# Altium schematic sheet cs301_Group5.SchDoc: CS301 Sensor PCB
size A4; Author: Group 5; DrawnBy: Group 5; SheetNumber: 1; SheetTotal: 2
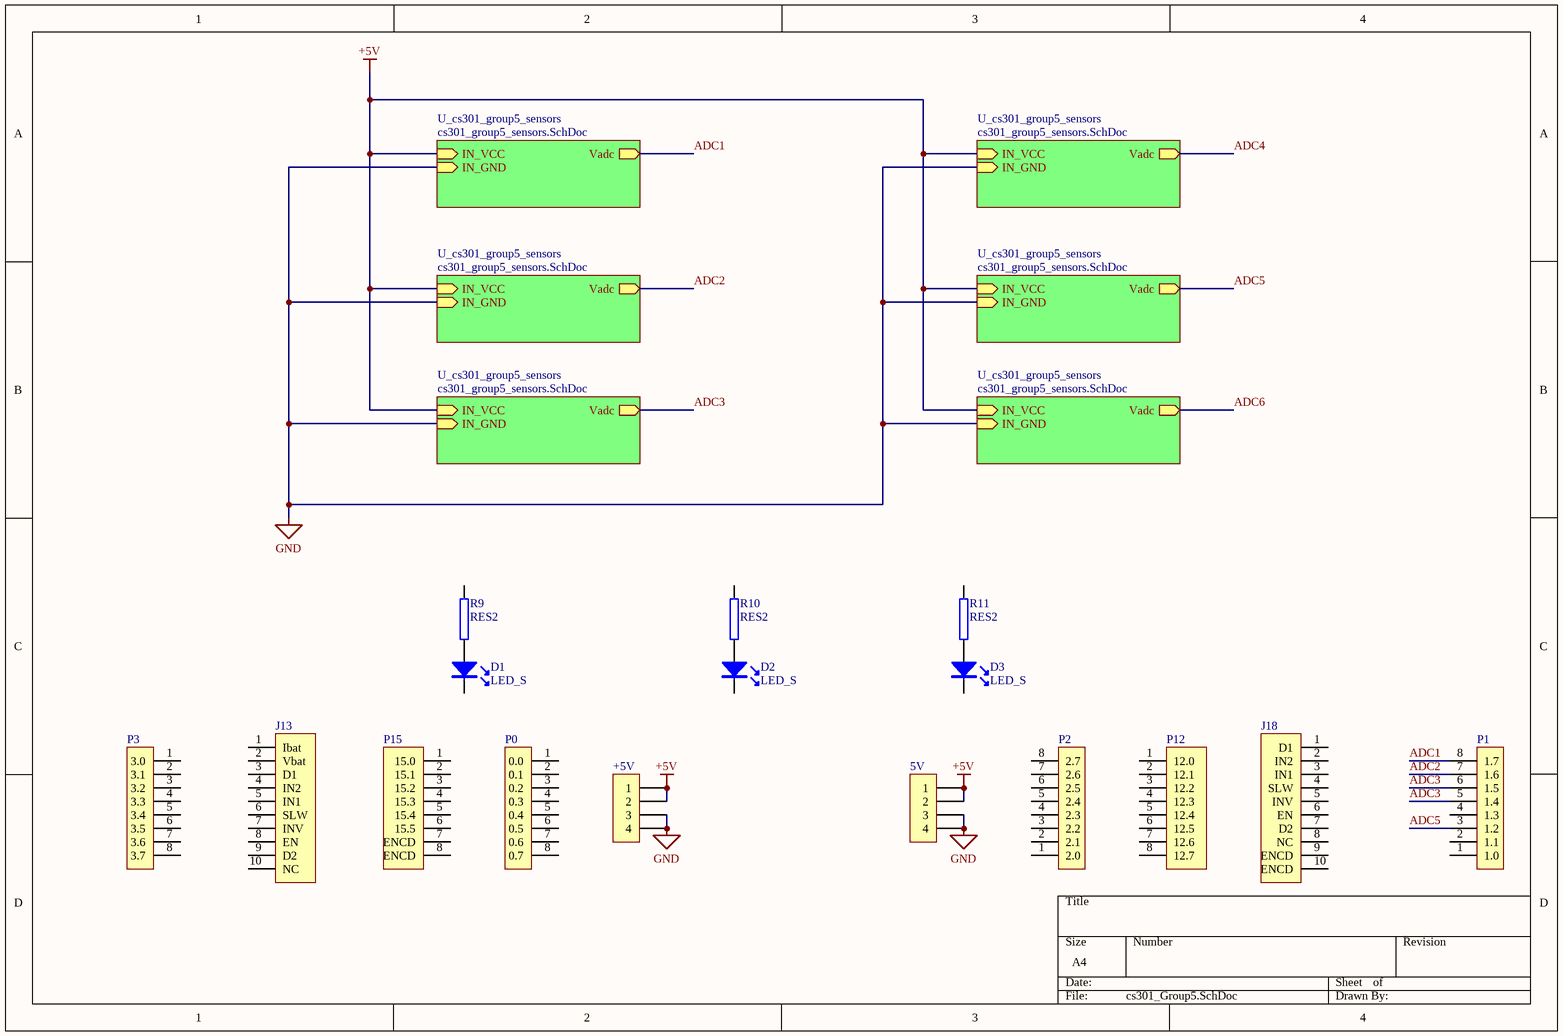
[diagram p0: cs301_Group5.SchDoc]

## Parts
5V  5V  [IDC4]  (value not drawn)
+5V  5V  [IDC4]  (value not drawn)
D1  LED_S  [LED0.1/5MM]
D2  LED_S  [LED0.1/5MM]
D3  LED_S  [LED0.1/5MM]
J13  CON10  [idc10]  (value not drawn)
J18  CON10  [IDC10]  (value not drawn)
P0  P0  [idc8]  (value not drawn)
P1  P1  [idc8]  (value not drawn)
P2  P2  [idc8]  (value not drawn)
P3  P3  [idc8]  (value not drawn)
P12  P12  [idc8]  (value not drawn)
P15  P15  [idc8]  (value not drawn)
R9  RES2  [AXIAL0.4]
R10  RES2  [AXIAL0.4]
R11  RES2  [AXIAL0.4]

## Sub-sheets
U_cs301_group5_sensors = cs301_group5_sensors.SchDoc: Vadc (out), IN_VCC (in), IN_GND (in)
U_cs301_group5_sensors = cs301_group5_sensors.SchDoc: Vadc (out), IN_VCC (in), IN_GND (in)
U_cs301_group5_sensors = cs301_group5_sensors.SchDoc: Vadc (out), IN_VCC (in), IN_GND (in)
U_cs301_group5_sensors = cs301_group5_sensors.SchDoc: Vadc (out), IN_VCC (in), IN_GND (in)
U_cs301_group5_sensors = cs301_group5_sensors.SchDoc: Vadc (out), IN_VCC (in), IN_GND (in)
U_cs301_group5_sensors = cs301_group5_sensors.SchDoc: Vadc (out), IN_VCC (in), IN_GND (in)

## Nets
+5V: 5V.1 5V.2 +5V.1 +5V.2 ; sheet U_cs301_group5_sensors/IN_VCC, sheet U_cs301_group5_sensors/IN_VCC, sheet U_cs301_group5_sensors/IN_VCC, sheet U_cs301_group5_sensors/IN_VCC, sheet U_cs301_group5_sensors/IN_VCC, sheet U_cs301_group5_sensors/IN_VCC
GND: 5V.3 5V.4 +5V.3 +5V.4 ; sheet U_cs301_group5_sensors/IN_GND, sheet U_cs301_group5_sensors/IN_GND, sheet U_cs301_group5_sensors/IN_GND, sheet U_cs301_group5_sensors/IN_GND, sheet U_cs301_group5_sensors/IN_GND, sheet U_cs301_group5_sensors/IN_GND
ADC1: P1.8(1.7) ; sheet U_cs301_group5_sensors/Vadc
ADC2: P1.7(1.6) ; sheet U_cs301_group5_sensors/Vadc
ADC3: P1.5(1.4) P1.6(1.5) ; sheet U_cs301_group5_sensors/Vadc
ADC4: sheet U_cs301_group5_sensors/Vadc
ADC5: P1.3(1.2) ; sheet U_cs301_group5_sensors/Vadc
ADC6: sheet U_cs301_group5_sensors/Vadc
NetD1_A: D1.A R9.1
NetD2_A: D2.A R10.1
NetD3_A: D3.A R11.2

Not connected (* = marked no-connect by the designer): D1 K(2); D2 K(2); D3 K(2); J13 1(Ibat) 2(Vbat) 3(D1) 4(IN2) 5(IN1) 6(SLW) 7(INV) 8(EN) 9(D2) 10(NC); J18 1(D1) 2(IN2) 3(IN1) 4(SLW) 5(INV) 6(EN) 7(D2) 8(NC) 9(ENCD) 10(ENCD); P0 1(0.0) 2(0.1) 3(0.2) 4(0.3) 5(0.4) 6(0.5) 7(0.6) 8(0.7); P1 1(1.0) 2(1.1) 4(1.3); P2 1(2.0) 2(2.1) 3(2.2) 4(2.3) 5(2.4) 6(2.5) 7(2.6) 8(2.7); P3 1(3.0) 2(3.1) 3(3.2) 4(3.3) 5(3.4) 6(3.5) 7(3.6) 8(3.7); P12 1(12.0) 2(12.1) 3(12.2) 4(12.3) 5(12.4) 6(12.5) 7(12.6) 8(12.7); P15 1(15.0) 2(15.1) 3(15.2) 4(15.3) 5(15.4) 6(15.5) 7(ENCD) 8(ENCD); R9 2; R10 2; R11 1

## Library data of the parts
5V +5V = CON4: Connector
D1-D3 = LED
J13 J18 = CON10: Connector
P0-P3 = CON8: Connector
P12 P15 = CON8_1: Connector